# EAGLE design DazzeLiteSch (EAGLE 9.6.0)
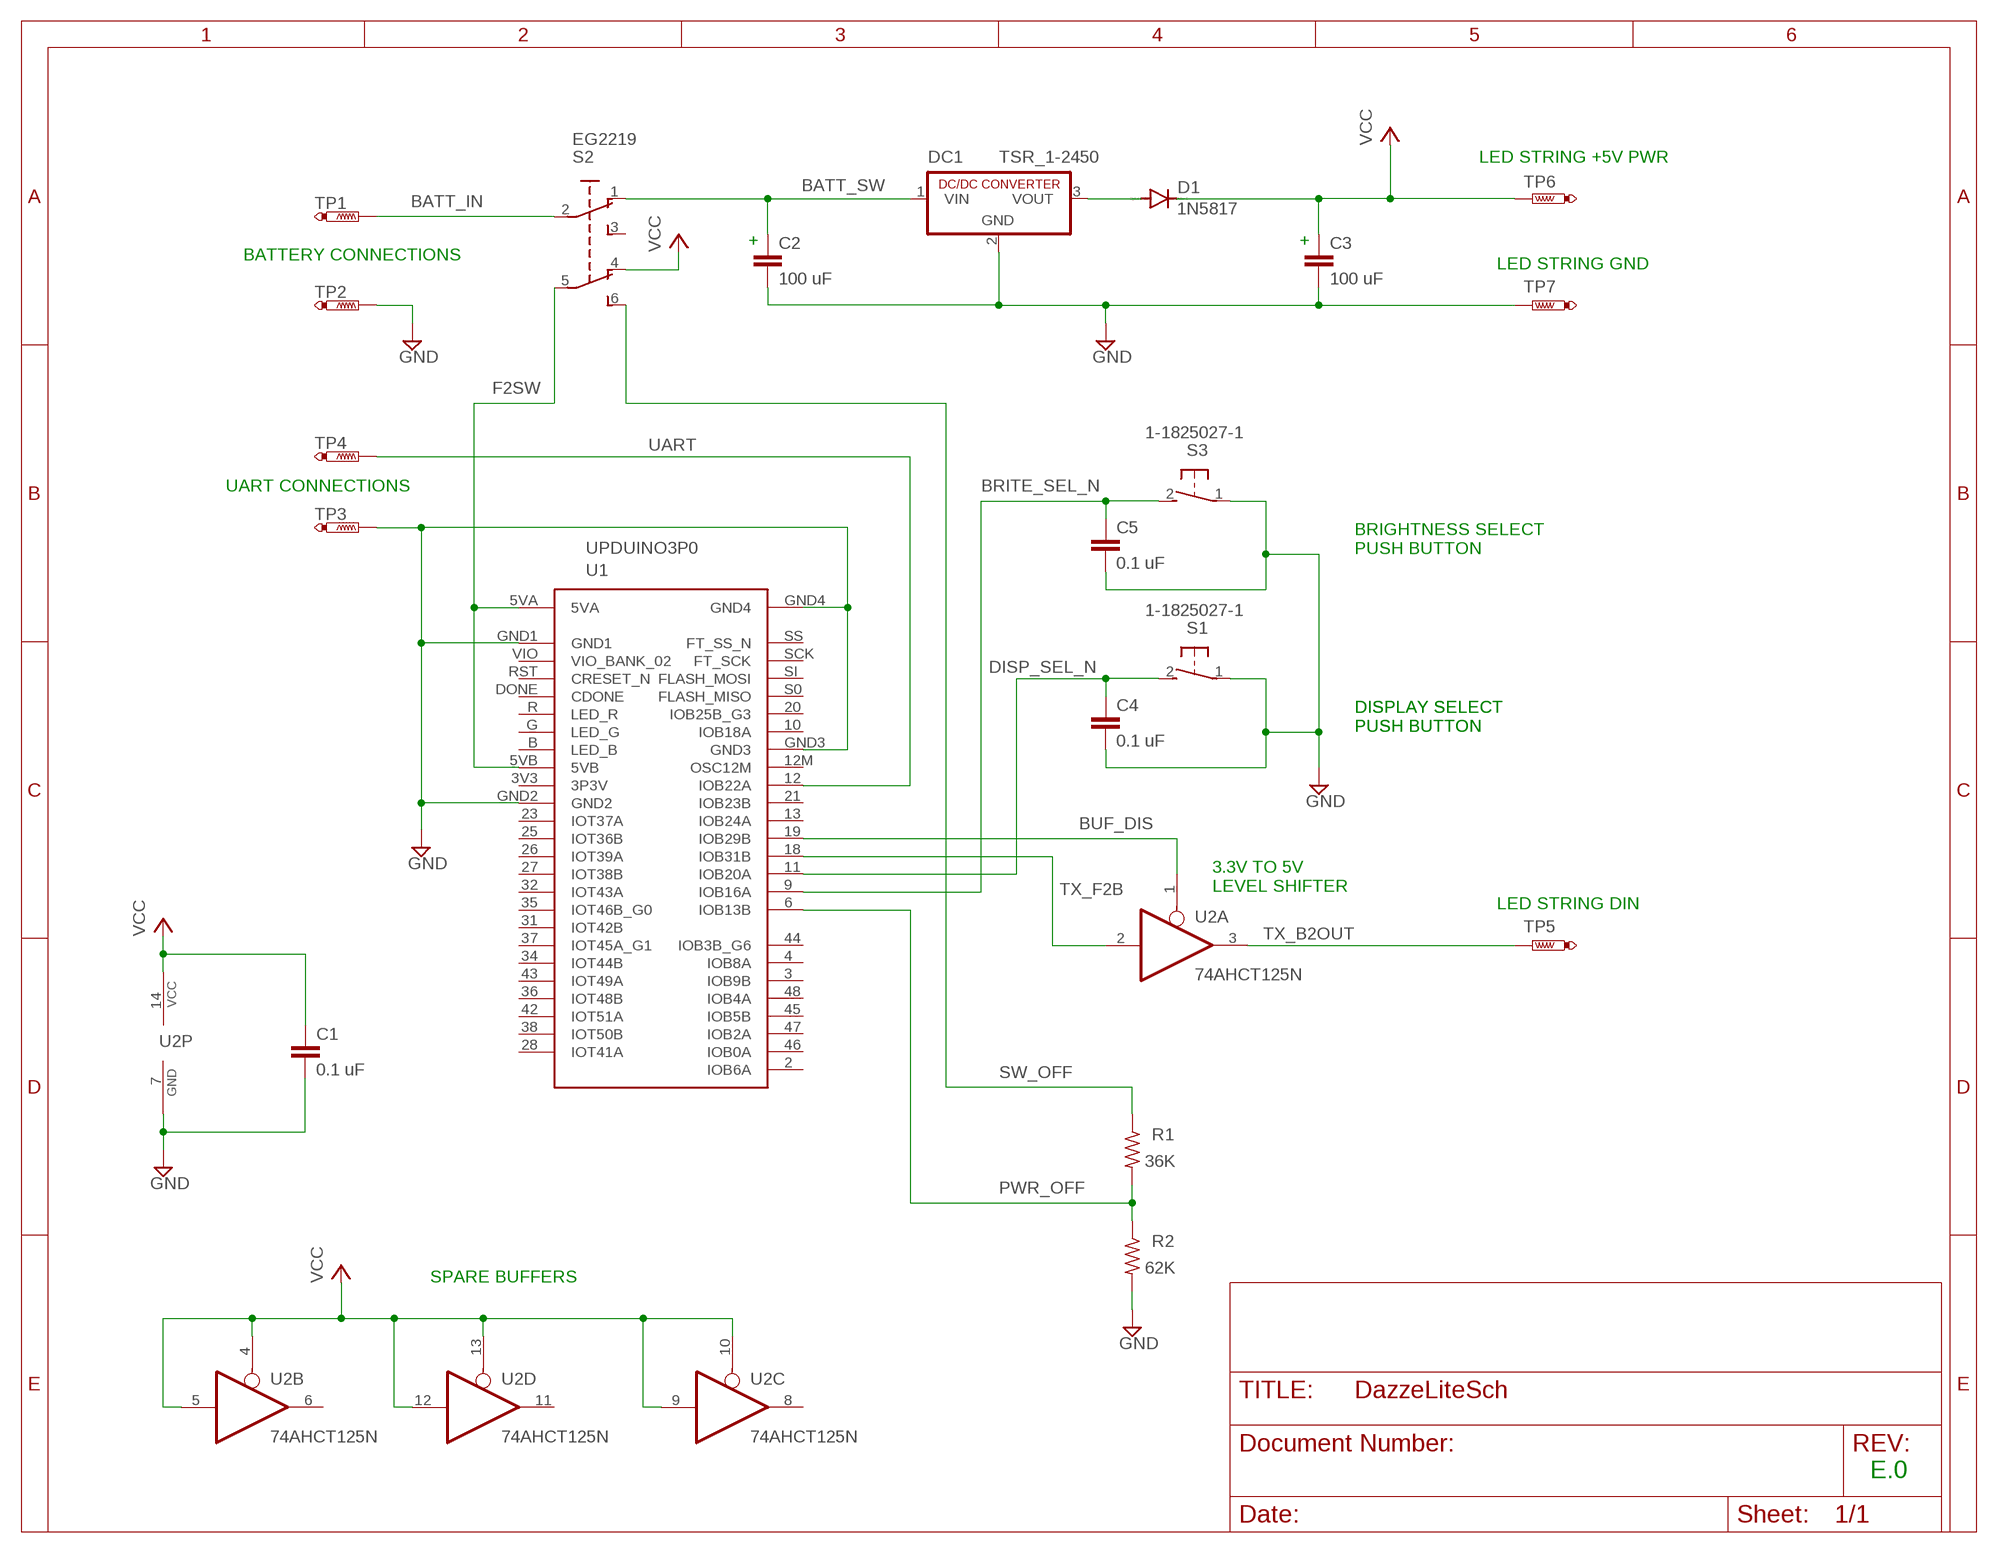
[diagram p0: schematic, sheet 1]

## Parts
C1  0.1 uF  C2,5-3  [C2.5-3]
C2  100 uF  C2.5/6  [C2.5-6]
C3  100 uF  C2.5/6  [C2.5-6]
C4  0.1 uF  C2,5-3  [C2.5-3]
C5  0.1 uF  C2,5-3  [C2.5-3]
D1  1N5817  DIODE-DO41-10  [DO41-10]
DC1  TSR_1-2450  [SIP3]
R1  36K  R-US_0204/7  [0204/7]
R2  62K  R-US_0204/7  [0204/7]
S1  1-1825027-1  [B3F-31XX]
S2  EG2219  [DPDT157]
S3  1-1825027-1  [B3F-31XX]
TP1  PTR1PAD1-13  [P1-13]
TP2  PTR1PAD1-13  [P1-13]
TP3  PTR1PAD1-13  [P1-13]
TP4  PTR1PAD1-13  [P1-13]
TP5  PTR1PAD1-13  [P1-13]
TP6  PTR1PAD1-13  [P1-13]
TP7  PTR1PAD1-13  [P1-13]
U1  UPDUINO3P0  [UPDUINO3P0]
U2  74AHCT125N  [DIL14]

## Nets
BATT_IN: S2.2(P) TP1.TP
BATT_SW: C2.1 DC1.1(VIN) S2.1(O)
BRITE_SEL_N: C5.1 S3.2(S) U1.9(IOB16A)
BUF_DIS: U1.19(IOB29B) U2.1(A:OE)
DISP_SEL_N: C4.1 S1.2(S) U1.11(IOB20A)
F2SW: S2.5(P1) U1.5VA U1.5VB
GND: C1.2 C2.2 C3.2 C4.2 C5.2 DC1.2(GND) R2.2 S1.1(P) S3.1(P) TP2.TP TP3.TP TP7.TP U1.GND1 U1.GND2 U1.GND3 U1.GND4 U2.7(P:GND)
N$1: D1.A DC1.3(VOUT)
PWR_OFF: R1.2 R2.1 U1.6(IOB13B)
SW_OFF: R1.1 S2.6(S1)
TX_B2OUT: TP5.TP U2.3(A:O)
TX_F2B: U1.18(IOB31B) U2.2(A:I)
UART: TP4.TP U1.12(IOB22A)
VCC: C1.1 C3.1 D1.C S2.4(O1) TP6.TP U2.4(B:OE) U2.5(B:I) U2.9(C:I) U2.10(C:OE) U2.12(D:I) U2.13(D:OE) U2.14(P:VCC)
Unconnected: S2.3(S) U1.2(IOB6A) U1.3(IOB9B) U1.3V3(3P3V) U1.4(IOB8A) U1.10(IOB18A) U1.12M(OSC12M) U1.13(IOB24A) U1.20(IOB25B_G3) U1.21(IOB23B) U1.23(IOT37A) U1.25(IOT36B) U1.26(IOT39A) U1.27(IOT38B) U1.28(IOT41A) U1.31(IOT42B) U1.32(IOT43A) U1.34(IOT44B) U1.35(IOT46B_G0) U1.36(IOT48B) U1.37(IOT45A_G1) U1.38(IOT50B) U1.42(IOT51A) U1.43(IOT49A) U1.44(IOB3B_G6) U1.45(IOB5B) U1.46(IOB0A) U1.47(IOB2A) U1.48(IOB4A) U1.B(LED_B) U1.DONE(CDONE) U1.G(LED_G) U1.R(LED_R) U1.RST(CRESET_N) U1.S0(FLASH_MISO) U1.SCK(FT_SCK) U1.SI(FLASH_MOSI) U1.SS(FT_SS_N) U1.VIO(VIO_BANK_02) U2.6(B:O) U2.8(C:O) U2.11(D:O)

## Notes on the sheet
- LED STRING +5V PWR
- + | +
- BATTERY CONNECTIONS
- LED STRING GND
- UART CONNECTIONS
- BRIGHTNESS SELECT 
  PUSH BUTTON
- DISPLAY SELECT
  PUSH BUTTON
- DISPLAY SELECT
  PUSH BUTTON
- 3.3V TO 5V
  LEVEL SHIFTER
- LED STRING DIN
- SPARE BUFFERS
- E.0

## Library data of the parts
C1-C5 = capacitor-wima:C: CAPACITOR naming: grid - package width
D1 = diode:DIODE-: DIODE
DC1 = StarLiteLib:TSR_1-24*: INNOLINE DC/DC-Converter 1.0 AMP SIP3 Single Output
R1 R2 = rcl:R-US_: RESISTOR, American symbol; SPICEPREFIX: R
S1 S3 = StarLiteLib:1-1825027-1: TI SWITCH; DIGIKEY: 450-1658-ND; MPN: 1-1825027-1
S2 = StarLiteLib:EG2219: SWITCH-DPDT
TP1-TP7 = testpad:PTR1: TEST PIN
U1 = StarLiteLib:UPDUINO3P0: UPduino v3.0 Board
U2 = StarLiteLib:74*125: Quad bus BUFFER, 3-state

## Net classes
0 default: clearance 0.205 mm

## Board
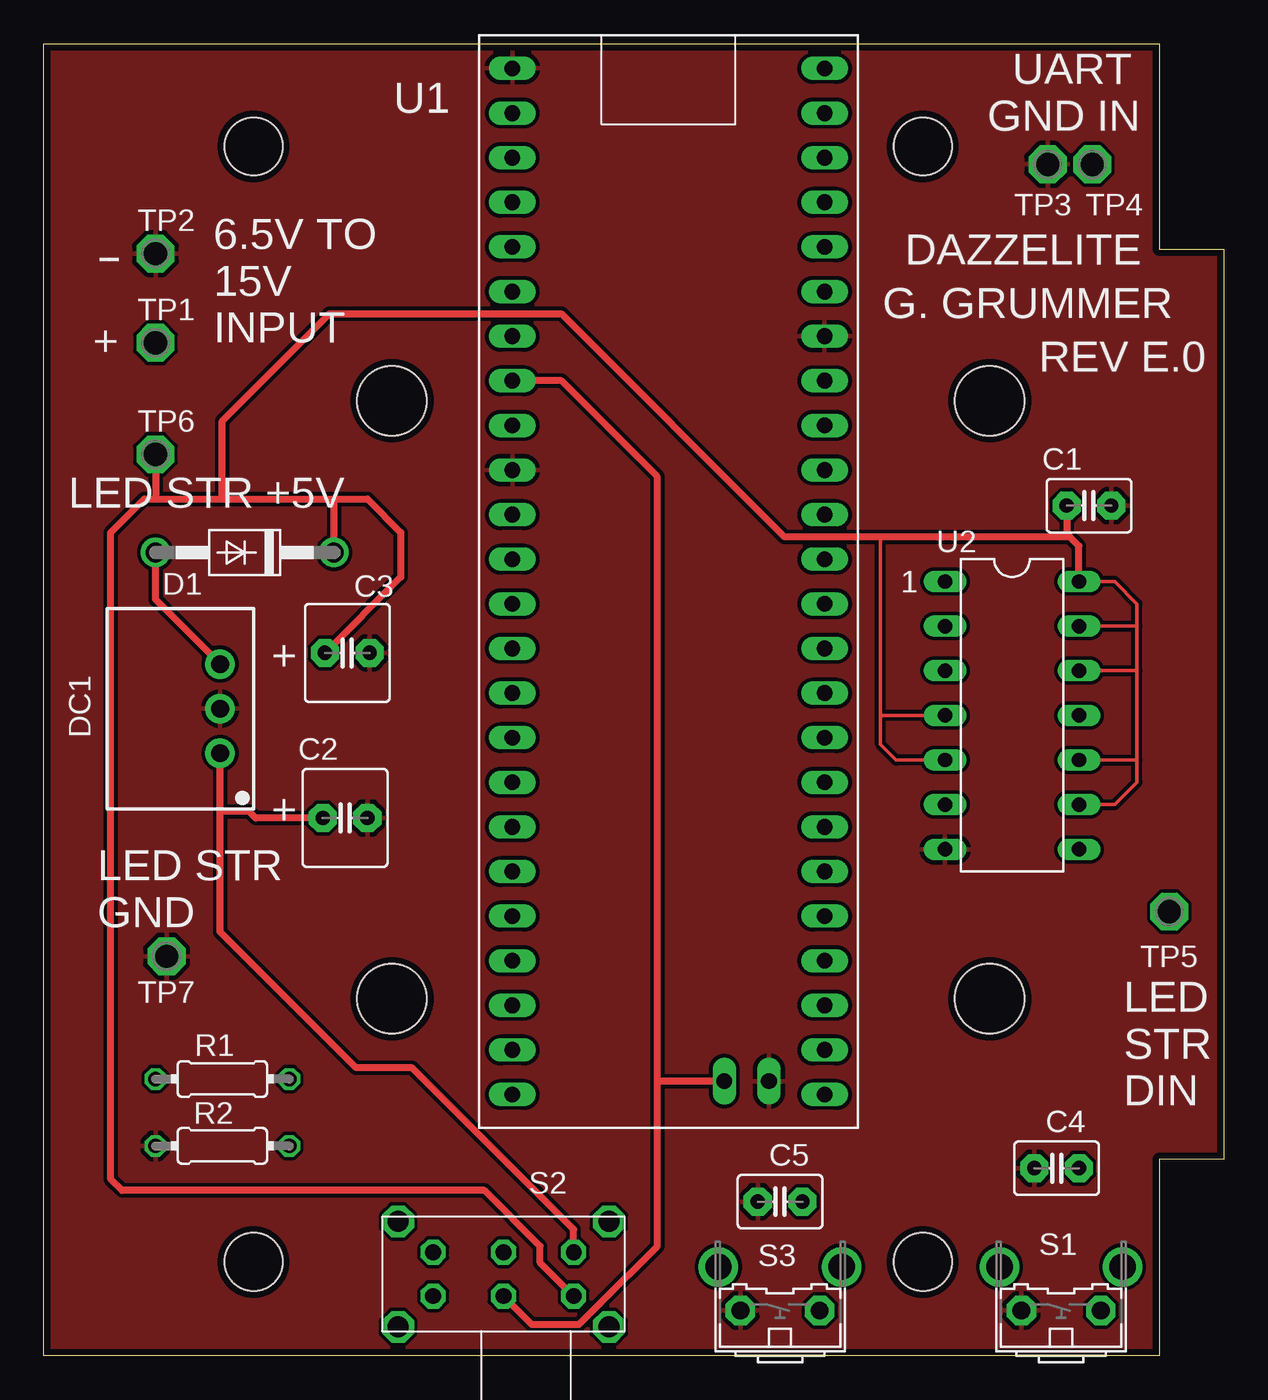
[diagram p1: board, top side]
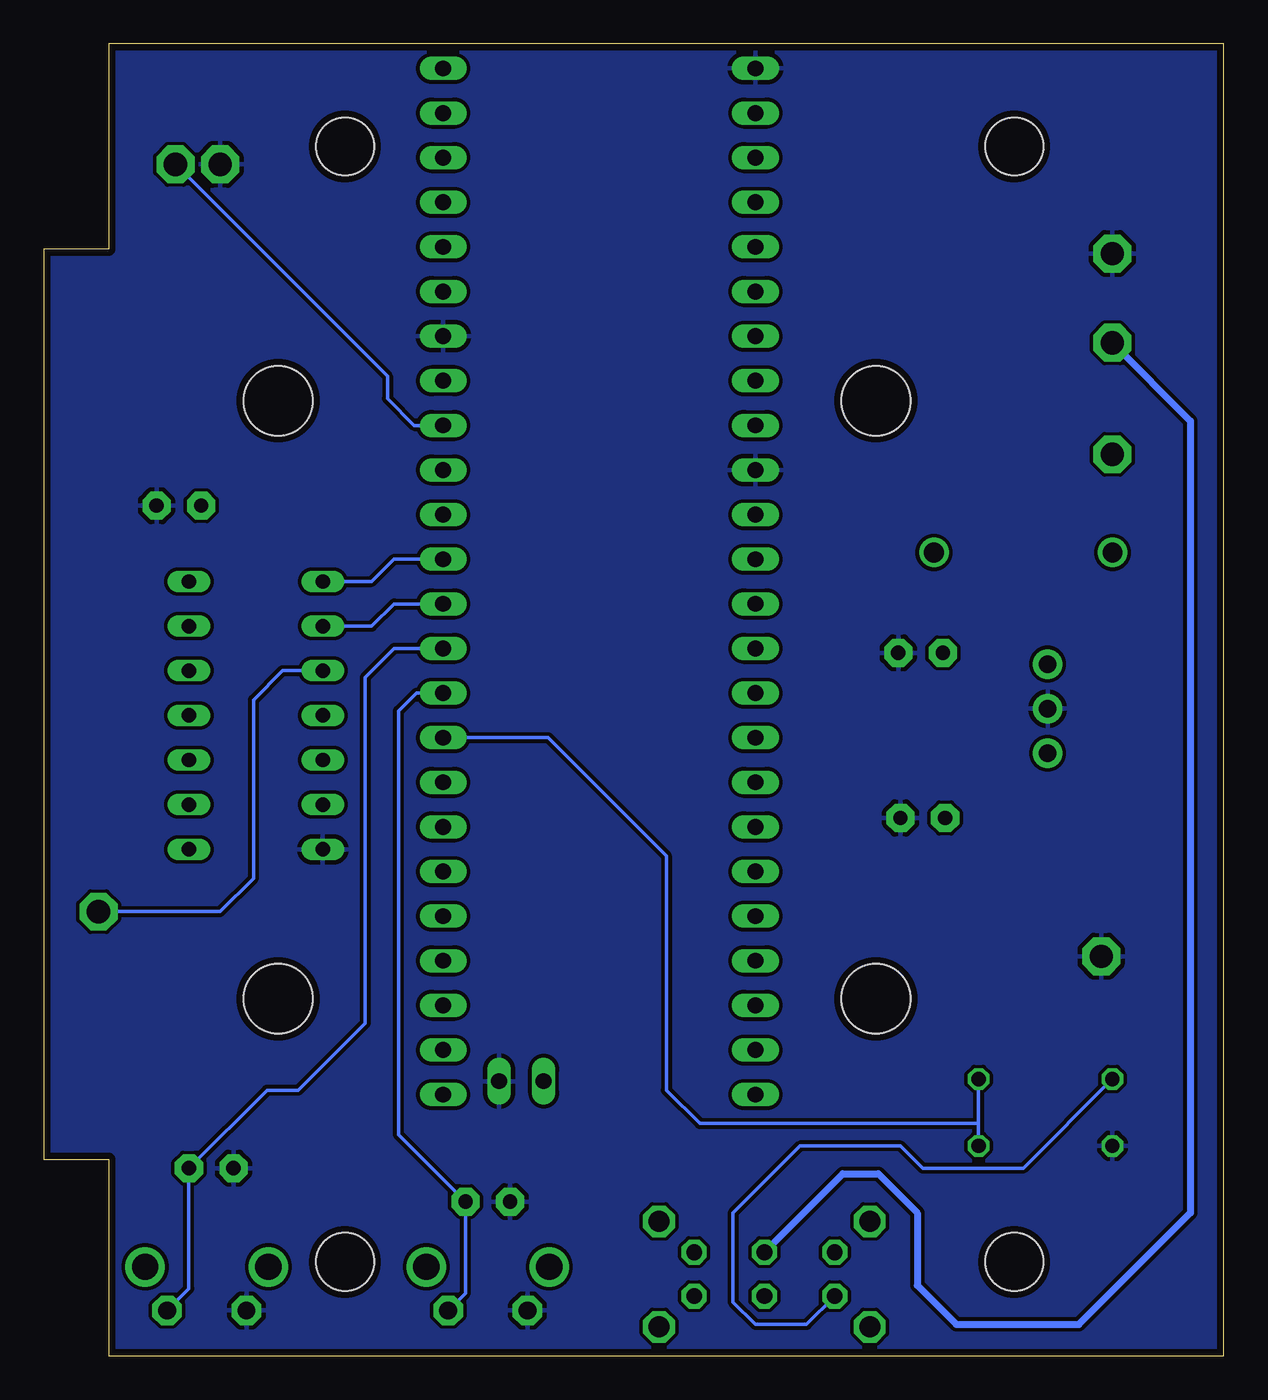
[diagram p2: board, bottom side, seen from below]

Size 67.18 x 74.68 mm. Coordinates in mm from the lower left corner, seen from the top.
Outline: 0,0 0,74.68 63.5,74.68 63.5,62.99 67.18,62.99 67.18,11.18 63.5,11.18 63.5,0 0,0
Copper layers (1*16): Top 0.0356mm / dielectric 1.5011mm / Bottom 0.0356mm
Design rules "LaenPCBOrder": minimum track width 6mil, minimum drill 13mil, track to track 6mil, track to pad 6mil, pad to pad 6mil, via to via 6mil, smd to smd 6mil, copper to edge 15mil, drill to drill 6mil, minimum pad ring 7mil, minimum via ring 7mil, stop-mask expansion 3mil, vias tented up to drill 0mil, thermal gap 10mil
Holes 3.3 mm at 11.94,68.83 50.04,68.83 11.94,5.33 50.04,5.33
Holes 3.96 mm at 19.81,54.36 53.85,54.36 19.81,20.32 53.85,20.32
tKeepout: area 50.3,50.8 to 57.4,57.9; area 16.2,50.8 to 23.4,57.9; area 16.2,16.7 to 23.4,23.9; area 50.3,16.7 to 57.4,23.9; area 9.1,66 to 14.7,71.6; area 47.2,66 to 52.8,71.6; area 47.2,2.5 to 52.8,8.1; area 9.1,2.5 to 14.7,8.1

### Footprints (pad centres in the part's own frame; a part is rotated, then mirrored left to right if it is on the bottom)
C2.5-3 = drill 0.813 pad 1.6 octagon: 1 -1.27,0; 2 1.27,0
C2.5-6 = drill 0.813 pad 1.6 octagon: 1 -1.27,0; 2 1.27,0
DO41-10 = drill 1.118: A 5.08,0; C -5.08,0
SIP3 = drill 1 pad 1.676: 1 -2.54,0; 2 0,0; 3 2.54,0
0204/7 = drill 0.813 octagon: 1 -3.81,0; 2 3.81,0
B3F-31XX = drill 1.016 pad 1.676 octagon: 1 -2.261,-1.245; 2 2.261,-1.245 | drill 1.499: 3 -3.505,1.245; 4 3.505,1.245
DPDT157 = drill 0.9 pad 1.422 octagon: 1 -4,-1.25; 2 0,-1.25; 3 4,-1.25; 4 -4,1.25; 5 0,1.25; 6 4,1.25 | drill 1.2 octagon: 7 6,3; 8 6,-3; 9 -6,-3; 10 -6,3
P1-13 = drill 1.321 pad 2.159 octagon: TP 0,0
UPDUINO3P0 = drill 0.9 long: 2 -24.13,-7.62; 3 -11.43,-7.62; 3V3 13.97,10.16; 4 -8.89,-7.62; 5VA -23.368,-1.905; 5VB 16.51,10.16; 6 -3.81,-7.62; 9 -1.27,-7.62; 10 21.59,-7.62; 11 1.27,-7.62; 12 13.97,-7.62; 12M 16.51,-7.62; 13 8.89,-7.62; 18 3.81,-7.62; 19 6.35,-7.62; 20 24.13,-7.62; 21 11.43,-7.62; 23 8.89,10.16; 25 6.35,10.16; 26 3.81,10.16; 27 1.27,10.16; 28 -24.13,10.16; 31 -6.35,10.16; 32 -1.27,10.16; 34 -11.43,10.16; 35 -3.81,10.16; 36 -16.51,10.16; 37 -8.89,10.16; 38 -21.59,10.16; 42 -19.05,10.16; 43 -13.97,10.16; 44 -6.35,-7.62; 45 -16.51,-7.62; 46 -21.59,-7.62; 47 -19.05,-7.62; 48 -13.97,-7.62; B 19.05,10.16; DONE 26.67,10.16; G 21.59,10.16; GND1 -23.368,-4.445; GND2 11.43,10.16; GND3 19.05,-7.62; GND4 34.29,10.16; R 24.13,10.16; RST 29.21,10.16; S0 26.67,-7.62; SCK 31.75,-7.62; SI 29.21,-7.62; SS 34.29,-7.62; VIO 31.75,10.16
DIL14 = drill 0.813 long: 1 -7.62,-3.81; 2 -5.08,-3.81; 3 -2.54,-3.81; 4 0,-3.81; 5 2.54,-3.81; 6 5.08,-3.81; 7 7.62,-3.81; 8 7.62,3.81; 9 5.08,3.81; 10 2.54,3.81; 11 0,3.81; 12 -2.54,3.81; 13 -5.08,3.81; 14 -7.62,3.81

### Placement (x,y rotation side)
C1  59.5,48.39 0 top
C2  17.14,30.61 0 top
C3  17.27,40.01 0 top
C4  57.66,10.67 180 top
C5  41.91,8.76 180 top
D1  11.43,45.72 180 top
DC1  10.03,36.83 90 top
R1  10.16,15.75 0 top
R2  10.16,11.94 180 top
S1  57.91,3.81 0 top
S2  26.16,4.64 180 top
S3  41.91,3.81 0 top
TP1  6.35,57.66 0 top
TP2  6.35,62.74 0 top
TP3  57.15,67.82 0 top
TP4  59.69,67.82 0 top
TP5  64.07,25.27 0 top
TP6  6.35,51.31 0 top
TP7  6.99,22.73 0 top
U1  36.83,38.99 90 top
U2  55.12,36.45 270 top

### Tracks (layer width: path | path; a pad name or v marks a point on that pad's centre or on a via)
BATT_IN
  Bottom 0.406: TP1.TP 1.91,53.21 1.91,8.13 8.26,1.78 15.24,1.78 17.46,4 17.46,8.13 19.68,10.35 21.7,10.35 S2.2
BATT_SW
  Top 0.406: 10.03,30.99 10.03,24.13 17.78,16.38 20.95,16.38 30.16,7.18 S2.1 | 10.03,30.99 DC1.1 | C2.1 12.06,30.61 11.68,30.99 10.03,30.99
BRITE_SEL_N
  Bottom 0.203: U1.9 45.97,37.72 46.99,36.7 46.99,12.57 C5.1 43.18,3.56 S3.2
BUF_DIS
  Bottom 0.203: U2.1 48.51,44.07 47.24,45.34 U1.19
DISP_SEL_N
  Bottom 0.203: U1.11 47.24,40.26 48.9,38.61 48.9,18.92 52.7,15.11 54.48,15.11 C4.1 58.93,3.81 S1.2
F2SW
  Top 0.406: 34.92,15.49 34.92,6.22 31.65,2.94 31.62,2.94 30.45,1.78 27.77,1.78 S2.5 | 34.92,15.49 34.92,50.04 29.46,55.5 U1.5VB | U1.5VA 35.05,15.62 34.92,15.49
GND
  pour Bottom: 0,74.68 63.5,74.68 63.5,62.99 67.18,62.99 67.18,11.18 63.5,11.18 63.5,0 0,0
  pour Top: 0,74.68 63.5,74.68 63.5,62.99 67.18,62.99 67.18,11.18 63.5,11.18 63.5,0 0,0
N$1
  Top 0.406: DC1.3 6.35,43.05 D1.A
PWR_OFF
  Bottom 0.203: R1.2 13.97,13.21 | 13.97,13.21 R2.1 | 13.97,13.21 29.84,13.21 31.75,15.11 31.75,28.45 38.48,35.18 U1.6
SW_OFF
  Bottom 0.203: R1.1 11.43,10.67 17.14,10.67 18.41,11.94 24.13,11.94 27.94,8.13 27.94,3.05 26.67,1.78 23.77,1.78 S2.6
TX_B2OUT
  Bottom 0.203: U2.3 53.59,38.99 55.24,37.34 55.24,27.18 57.15,25.27 TP5.TP
TX_F2B
  Bottom 0.203: U2.2 48.51,41.53 47.24,42.8 U1.18
UART
  Bottom 0.203: U1.12 46.1,52.96 47.62,54.48 47.62,55.75 TP4.TP
VCC
  Top 0.203: U2.9 60.96,31.37 62.23,32.64 62.23,33.91 | 62.23,33.91 62.23,38.99 | 62.23,38.99 62.23,41.53 | 62.23,41.53 62.23,42.8 60.96,44.07 U2.14 | U2.13 62.23,41.53 | U2.12 62.23,38.99 | U2.10 62.23,33.91 | U2.5 48.51,33.91 47.62,34.8 47.62,36.32 | 47.62,36.32 47.62,46.61 | 47.62,36.32 47.75,36.45 U2.4
  Top 0.406: 6.35,48.77 5.71,48.77 3.81,46.86 3.81,10.03 4.45,9.4 25.08,9.4 28.26,6.22 28.26,5.29 S2.4 | 6.35,48.77 10.16,48.77 | 10.16,48.77 16.51,48.77 | 16.51,48.77 18.41,48.77 20.32,46.86 20.32,44.32 C3.1 | D1.C 16.51,48.77 | TP6.TP 6.35,48.77 | 10.16,48.77 10.16,53.21 16.26,59.31 29.46,59.31 42.16,46.61 47.62,46.61 58.42,46.61 | C1.1 58.23,46.8 58.42,46.61 | U2.14 58.93,46.1 58.42,46.61

### Text on the board
tPlace: UART | GND | IN | DAZZELITE | - | - | G. GRUMMER | 6.5V TO / 15V / INPUT | + | REV E.0 | LED STR +5V | 1 | + | + | LED STR / GND | LED / STR / DIN